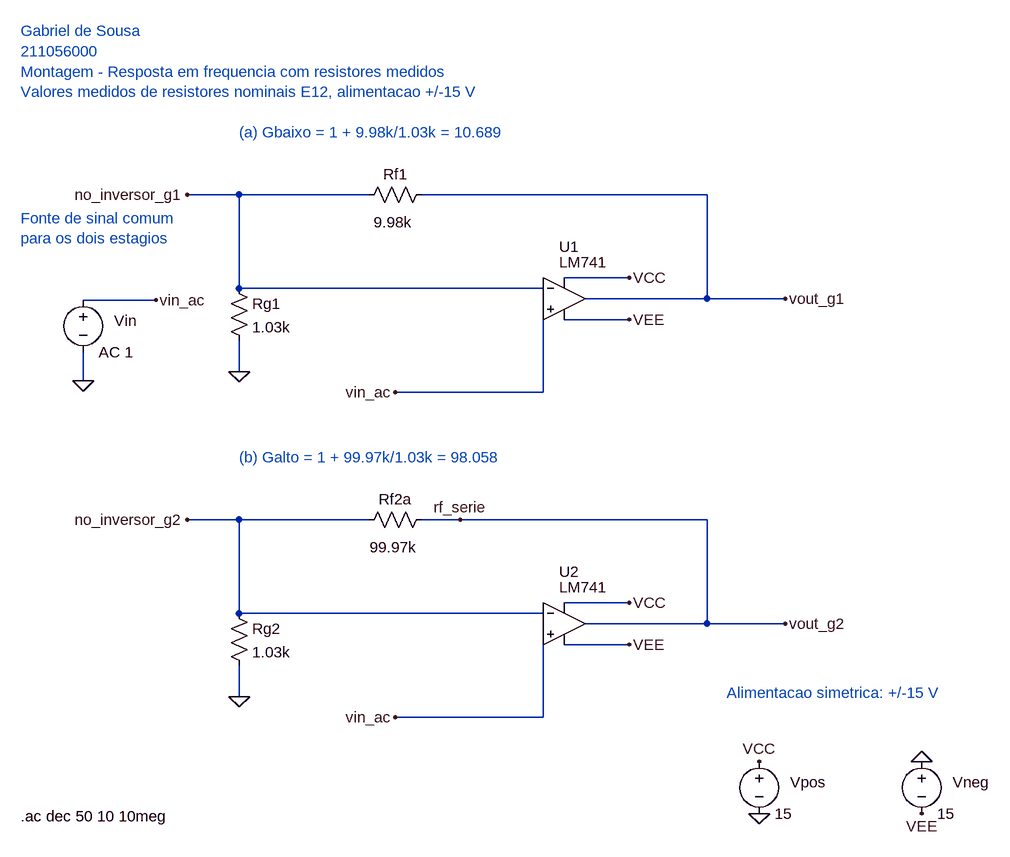
[diagram p0: schematic montagem_frequencia.asc]
montagem_frequencia.asc, the LTspice schematic file:
Version 4.1
SHEET 1 1600 1200
TEXT 64 -48 Left 2 ;Gabriel de Sousa\n211056000\nMontagem - Resposta em frequencia com resistores medidos\nValores medidos de resistores nominais E12, alimentacao +/-15 V
TEXT 64 240 Left 2 ;Fonte de sinal comum\npara os dois estagios
SYMBOL voltage 160 350 R0
WINDOW 0 48 48 Left 2
SYMATTR InstName Vin
SYMATTR Value AC 1
WIRE 160 366 272 366
FLAG 272 366 vin_ac
WIRE 160 446 160 490
FLAG 160 490 0
TEXT 400 108 Left 2 ;(a) Gbaixo = 1 + 9.98k/1.03k = 10.689
SYMBOL LM741 900 300 R0
WINDOW 0 -8 -16 Left 2
WINDOW 3 -8 8 Left 2
SYMATTR InstName U1
WIRE 900 332 1000 332
FLAG 1000 332 VCC
WIRE 900 396 1000 396
FLAG 1000 396 VEE
WIRE 400 348 868 348
WIRE 400 348 400 204
WIRE 400 204 600 204
WIRE 1120 204 1120 364
WIRE 932 364 1240 364
WIRE 400 428 400 476
WIRE 868 380 868 508
WIRE 868 508 640 508
SYMBOL res 384 332 R0
SYMATTR InstName Rg1
SYMATTR Value 1.03k
FLAG 400 476 0
WIRE 400 204 320 204
FLAG 320 204 no_inversor_g1
FLAG 1240 364 vout_g1
FLAG 640 508 vin_ac
SYMBOL res 696 188 R90
WINDOW 0 0 56 VBottom 2
WINDOW 3 58 59 VCenter 2
SYMATTR InstName Rf1
SYMATTR Value 9.98k
WIRE 680 204 1120 204
TEXT 400 608 Left 2 ;(b) Galto = 1 + 99.97k/1.03k = 98.058
SYMBOL LM741 900 800 R0
WINDOW 0 -8 -16 Left 2
WINDOW 3 -8 8 Left 2
SYMATTR InstName U2
WIRE 900 832 1000 832
FLAG 1000 832 VCC
WIRE 900 896 1000 896
FLAG 1000 896 VEE
WIRE 400 848 868 848
WIRE 400 848 400 704
WIRE 400 704 600 704
WIRE 1120 704 1120 864
WIRE 932 864 1240 864
WIRE 400 928 400 976
WIRE 868 880 868 1008
WIRE 868 1008 640 1008
SYMBOL res 384 832 R0
SYMATTR InstName Rg2
SYMATTR Value 1.03k
FLAG 400 976 0
WIRE 400 704 320 704
FLAG 320 704 no_inversor_g2
FLAG 1240 864 vout_g2
FLAG 640 1008 vin_ac
SYMBOL res 696 688 R90
WINDOW 0 0 56 VBottom 2
WINDOW 3 58 59 VCenter 2
SYMATTR InstName Rf2a
SYMATTR Value 99.97k
WIRE 680 704 800 704
WIRE 800 704 880 704
WIRE 880 704 1120 704
TEXT 1150 970 Left 2 ;Alimentacao simetrica: +/-15 V
SYMBOL voltage 1200 1060 R0
WINDOW 0 48 48 Left 2
SYMATTR InstName Vpos
SYMATTR Value 15
SYMBOL voltage 1450 1060 R0
WINDOW 0 48 48 Left 2
SYMATTR InstName Vneg
SYMATTR Value 15
FLAG 1200 1076 VCC
FLAG 1200 1156 0
FLAG 1450 1076 0
FLAG 1450 1156 VEE
TEXT 64 1160 Left 2 !.ac dec 50 10 10meg
FLAG 740 704 rf_serie

The netlist it stands for:
* montagem_frequencia.asc
Vin vin_ac 0 AC 1
X§U1 vin_ac no_inversor_g1 VCC VEE vout_g1 LM741  ; pins In+ In- V+ V- OUT
Rg1 no_inversor_g1 0 1.03k
Rf1 vout_g1 no_inversor_g1 9.98k
X§U2 vin_ac no_inversor_g2 VCC VEE rf_serie LM741  ; pins In+ In- V+ V- OUT
Rg2 no_inversor_g2 0 1.03k
Rf2a rf_serie no_inversor_g2 99.97k
Vpos VCC 0 15
Vneg 0 VEE 15
* Gabriel de Sousa
* 211056000
* Montagem - Resposta em frequencia com resistores medidos
* Valores medidos de resistores nominais E12, alimentacao +/-15 V
* Fonte de sinal comum
* para os dois estagios
* (a) Gbaixo = 1 + 9.98k/1.03k = 10.689
* (b) Galto = 1 + 99.97k/1.03k = 98.058
* Alimentacao simetrica: +/-15 V
.ac dec 50 10 10meg
.lib LM741.lib
.backanno
.end